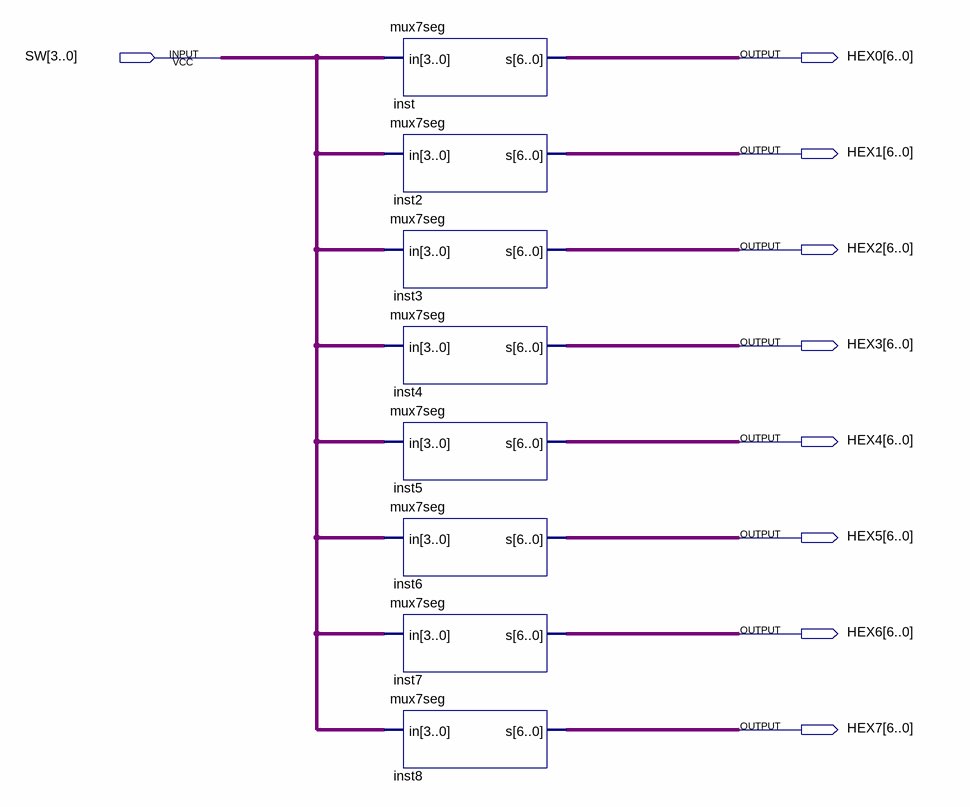
[diagram p0: schematic sheet]
// Quartus schematic 7seg_tst.bdf as structural Verilog: 8 symbols, 9 pins
module \7seg_tst  (
  input  [3:0] SW,
  output [6:0] HEX0,
  output [6:0] HEX1,
  output [6:0] HEX2,
  output [6:0] HEX3,
  output [6:0] HEX4,
  output [6:0] HEX5,
  output [6:0] HEX6,
  output [6:0] HEX7
);

  mux7seg inst (.in(SW), .s(HEX0));
  mux7seg inst2 (.in(SW), .s(HEX1));
  mux7seg inst3 (.in(SW), .s(HEX2));
  mux7seg inst4 (.in(SW), .s(HEX3));
  mux7seg inst5 (.in(SW), .s(HEX4));
  mux7seg inst6 (.in(SW), .s(HEX5));
  mux7seg inst7 (.in(SW), .s(HEX6));
  mux7seg inst8 (.in(SW), .s(HEX7));
endmodule
